# EAGLE design MicroKeyboard (EAGLE 9.6.2)
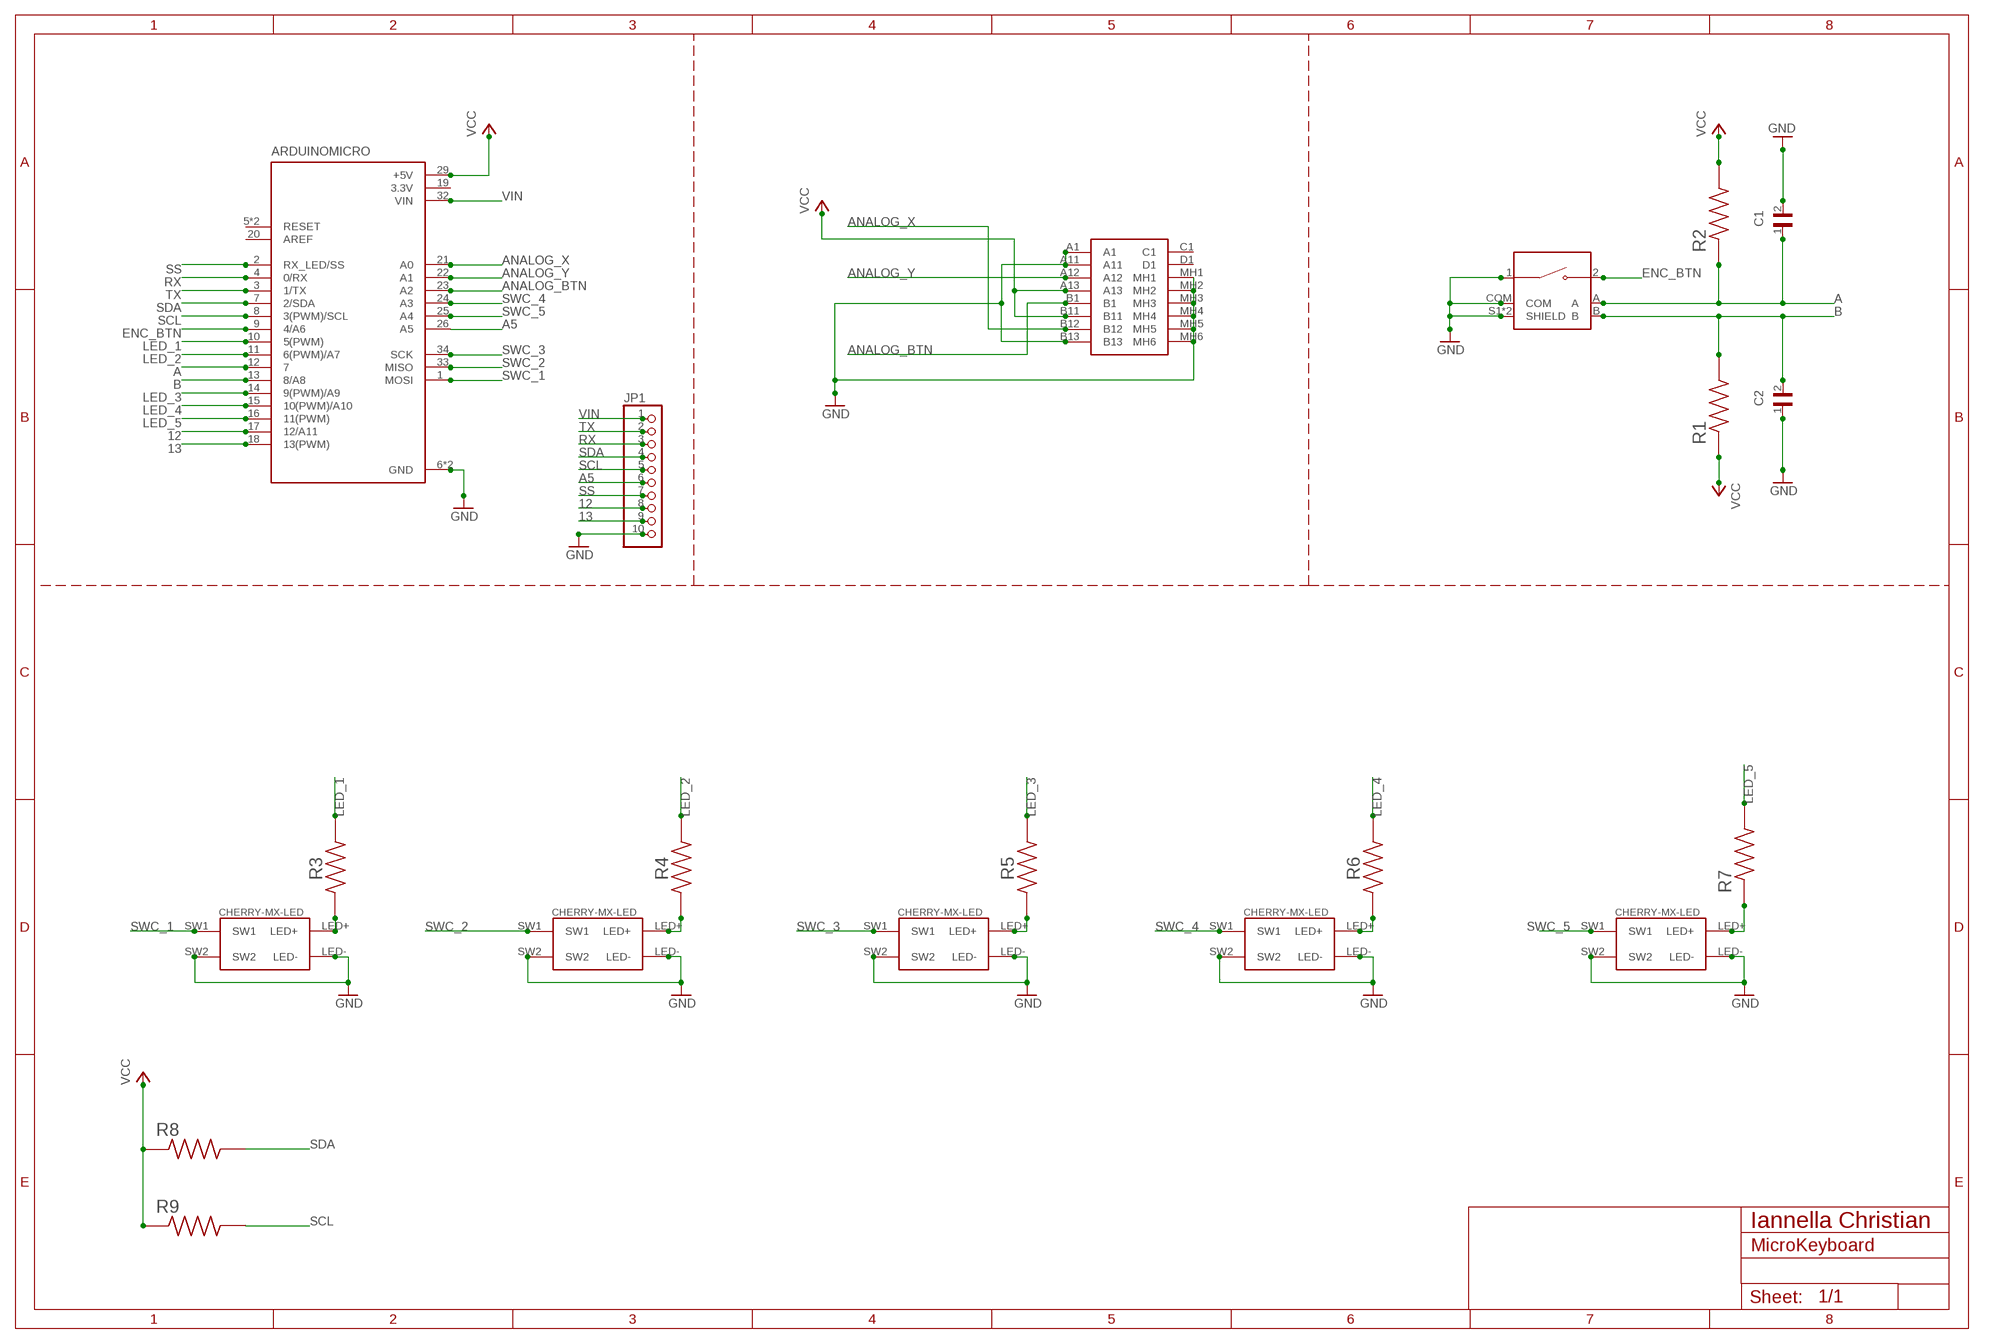
[diagram p0: schematic, sheet 1]

## Parts
ARDUINOMICRO  A000053  [ARDUINO_A000053]
C1  0805YC103J4T2A  [CAPC2012X94N]
C2  0805YC103J4T2A  [CAPC2012X94N]
JP1  PINHD-1X10  [1X10]
MT1  PEC11R-4215F-S0024  [XDCR_PEC11R-4215F-S0024]
R1  RC0805FR-07330RL  [RESC2012X60N]
R2  RC0805FR-07330RL  [RESC2012X60N]
R3  RC0805FR-07330RL  [RESC2012X60N]
R4  RC0805FR-07330RL  [RESC2012X60N]
R5  RC0805FR-07330RL  [RESC2012X60N]
R6  RC0805FR-07330RL  [RESC2012X60N]
R7  RC0805FR-07330RL  [RESC2012X60N]
R8  RC0805FR-07330RL  [RESC2012X60N]
R9  RC0805FR-07330RL  [RESC2012X60N]
S1  RKJXV122400R  [RKJXV122400R]
SWC_1  SWC_1  CHERRY-MX-LED  [CHERRY-MX-LED]
U$1  CHERRY-MX-LED  [CHERRY-MX-LED]
U$2  CHERRY-MX-LED  [CHERRY-MX-LED]
U$3  CHERRY-MX-LED  [CHERRY-MX-LED]
U$5  CHERRY-MX-LED  [CHERRY-MX-LED]

## Nets
12: ARDUINOMICRO.17(12/A11) JP1.8
13: ARDUINOMICRO.18(13(PWM)) JP1.9
A: ARDUINOMICRO.12 C1.1 MT1.A R2.1
A5: ARDUINOMICRO.26(A5) JP1.6
ANALOG_BTN: ARDUINOMICRO.23(A2) S1.B1
ANALOG_X: ARDUINOMICRO.21(A0) S1.B12
ANALOG_Y: ARDUINOMICRO.22(A1) S1.A12
B: ARDUINOMICRO.13(8/A8) C2.2 MT1.B R1.2
ENC_BTN: ARDUINOMICRO.9(4/A6) MT1.2
GND: ARDUINOMICRO.6(GND) ARDUINOMICRO.31(GND) C1.2 C2.1 JP1.10 MT1.1 MT1.COM MT1.S1(SHIELD) MT1.S2(SHIELD) S1.A1 S1.A11 S1.B13 S1.MH1 S1.MH2 S1.MH3 S1.MH4 S1.MH5 S1.MH6 SWC_1.LED- SWC_1.SW2 U$1.LED- U$1.SW2 U$2.LED- U$2.SW2 U$3.LED- U$3.SW2 U$5.LED- U$5.SW2
LED_1: ARDUINOMICRO.10(5(PWM)) R3.2
LED_2: ARDUINOMICRO.11(6(PWM)/A7) R4.2
LED_3: ARDUINOMICRO.14(9(PWM)/A9) R5.2
LED_4: ARDUINOMICRO.15(10(PWM)/A10) R6.2
LED_5: ARDUINOMICRO.16(11(PWM)) R7.2
N$1: R3.1 SWC_1.LED+
N$2: R7.1 U$3.LED+
N$3: R5.1 U$1.LED+
N$4: R4.1 U$5.LED+
N$5: R6.1 U$2.LED+
RX: ARDUINOMICRO.4(0/RX) JP1.3
SCL: ARDUINOMICRO.8(3(PWM)/SCL) JP1.5 R9.2
SDA: ARDUINOMICRO.7(2/SDA) JP1.4 R8.2
SS: ARDUINOMICRO.2(RX_LED/SS) JP1.7
SWC_1: ARDUINOMICRO.1(MOSI) SWC_1.SW1
SWC_2: ARDUINOMICRO.33(MISO) U$5.SW1
SWC_3: ARDUINOMICRO.34(SCK) U$1.SW1
SWC_4: ARDUINOMICRO.24(A3) U$2.SW1
SWC_5: ARDUINOMICRO.25(A4) U$3.SW1
TX: ARDUINOMICRO.3(1/TX) JP1.2
VCC: ARDUINOMICRO.29(+5V) R1.1 R2.2 R8.1 R9.1 S1.A13 S1.B11
VIN: ARDUINOMICRO.32(VIN) JP1.1
Unconnected: ARDUINOMICRO.5(RESET) ARDUINOMICRO.20(AREF) ARDUINOMICRO.30(RESET) S1.C1 S1.D1

## Notes on the sheet
- Iannella Christian

## Power pins joined to a net without a drawn wire
3.3V: ARDUINOMICRO.19(3.3V)

## Library data of the parts
ARDUINOMICRO = A000053:A000053: MCU, ARDUINO MICRO, LEONARDO BASED, ATMEGA32u4, 5V, USB-MICRO Check availability <https://pricing.snapeda.com/parts/Arduino%20Micro/Arduino/view-part?ref=eda>; AVAILABILITY: Not in stock; DESCRIPTION: Microcontroller board based on the ATmega32u4; MF: Arduino; MP: Arduino Micro; PACKAGE: Non-Standard Arduino; PRICE: None
C1 C2 = 0805YC103J4T2A:0805YC103J4T2A: Cap Ceramic 0.01uF 16V X7R 5% SMD 0805 125°C Paper T/R Check availability <https://pricing.snapeda.com/parts/0805YC103J4T2A/AVX/view-part?ref=eda>; AVAILABILITY: In Stock; DESCRIPTION: 10000 pF ±5% 16V Ceramic Capacitor X7R 0805 (2012 Metric); MF: AVX; MP: 0805YC103J4T2A; PACKAGE: 2012 AVX; PRICE: None; PURCHASE-URL: https://pricing.snapeda.com/search/part/0805YC103J4T2A/?ref=eda
JP1 = pinhead:PINHD-1X10: PIN HEADER
MT1 = PEC11R-4215F-S0024:PEC11R-4215F-S0024: Incremental Encoder, 12 Mm, Contact Rating 10 Ma - 5 Vdc Check availability <https://pricing.snapeda.com/parts/PEC11R-4215F-S0024/Bourns/view-part?ref=eda>; AVAILABILITY: In Stock; DESCRIPTION: Rotary Encoder Mechanical 24 Quadrature (Incremental) Vertical; MF: Bourns; MP: PEC11R-4215F-S0024; PACKAGE: None; PRICE: None; PURCHASE-URL: https://pricing.snapeda.com/search/part/PEC11R-4215F-S0024/?ref=eda
R1-R9 = RC0805FR-07330RL:RC0805FR-07330RL: Resistor SMD [YAGEO] RC0805FR-07330RL Resistor SMD Check availability <https://pricing.snapeda.com/parts/RC0805FR-07330RL/Yageo/view-part?ref=eda>; AVAILABILITY: In Stock; DESCRIPTION: 330 Ohms ±1% 0.125W, 1/8W Chip Resistor 0805 (2012 Metric) Moisture Resistant Thick Film; MF: Yageo; MP: RC0805FR-07330RL; PACKAGE: 2012 Rohm Semiconductor; PRICE: None; PURCHASE-URL: https://pricing.snapeda.com/search/part/RC0805FR-07330RL/?ref=eda
S1 = RKJXV122400R:RKJXV122400R: RKJXV122400R Source: Datasheet <https://tech.alpsalpine.com/prod/e/html/multicontrol/potentiometer/rkjxk/rkjxv122400r.html>; DESCRIPTION: RKJXV122400R; HEIGHT: 18.95mm; MANUFACTURER_NAME: ALPS Electric; MANUFACTURER_PART_NUMBER: RKJXV122400R; MOUSER_PART_NUMBER: 688-RKJXV122400R; MOUSER_PRICE-STOCK: https://www.mouser.co.uk/ProductDetail/Alps-Alpine/RKJXV122400R?qs=GedFDFLaBXEbB%252ByoOVwLBg%3D%3D
SWC_1 U$1-U$3 U$5 = cherrymx:CHERRY-MX-LED: Cherry MX series keyswitch with LED

## Board
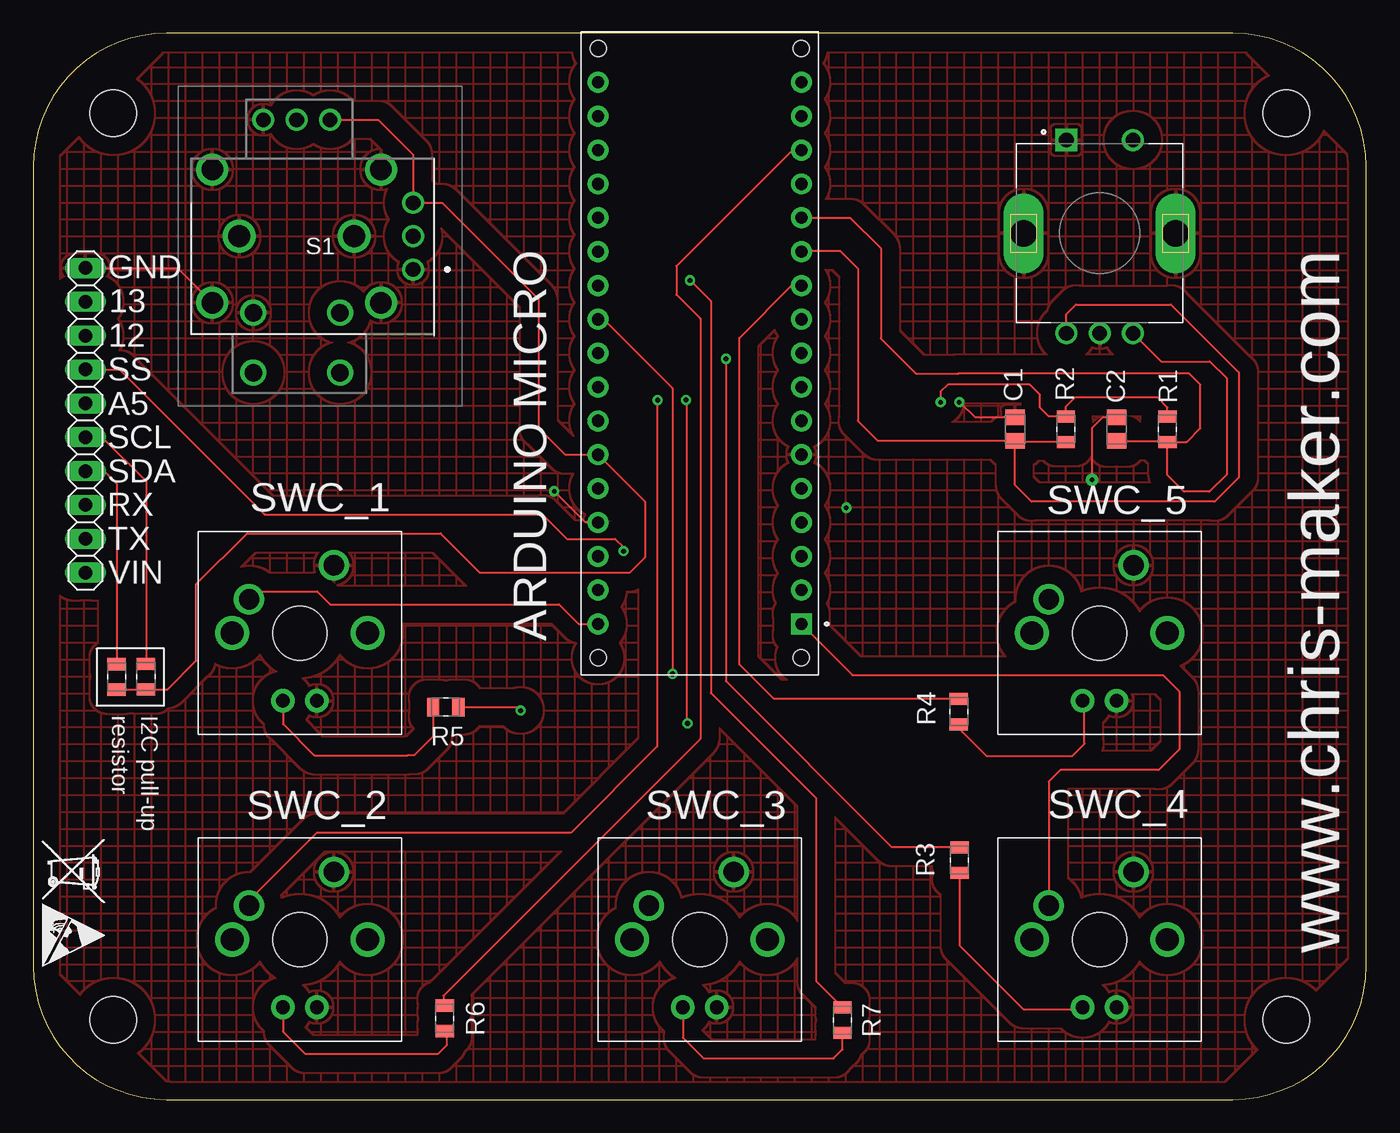
[diagram p1: board, top side]
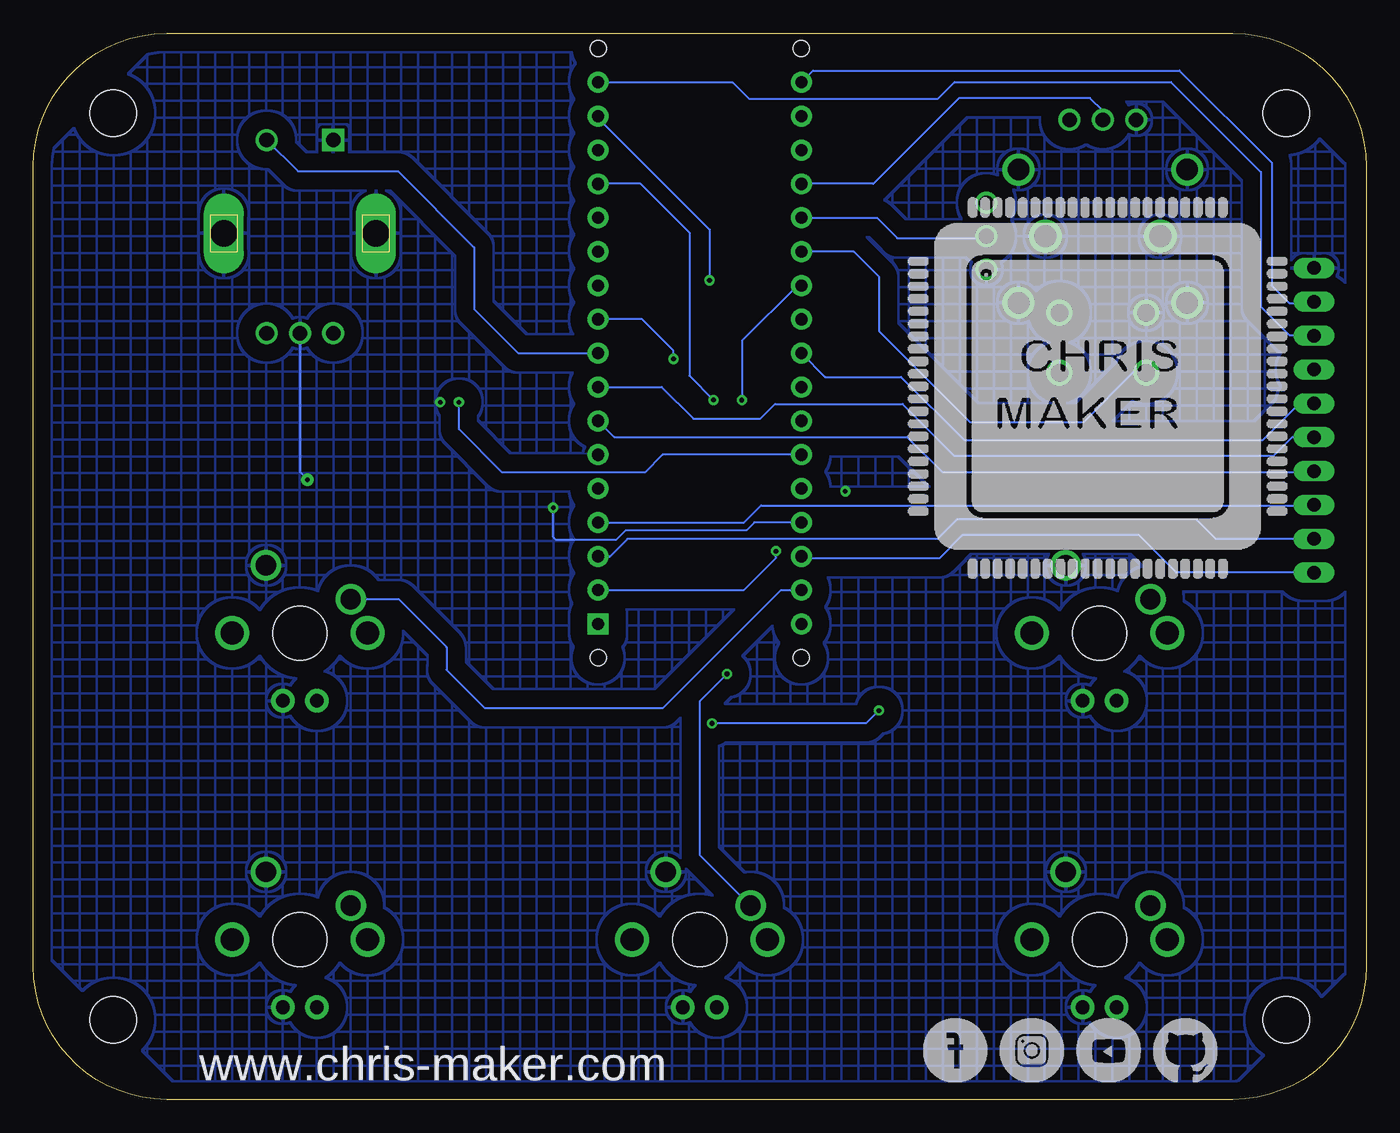
[diagram p2: board, bottom side, seen from below]

Size 100 x 80 mm. Coordinates in mm from the lower left corner, seen from the top.
Outline: 0,10 arc90 10,0 90,0 arc90 100,10 100,70 arc90 90,80 10,80 arc90 0,70 0,10
Copper layers (1*16): Top 0.035mm / dielectric 1.5mm / Bottom 0.035mm
Design rules "default": minimum track width 6mil, minimum drill 0.35mm, track to track 6mil, track to pad 6mil, pad to pad 6mil, via to via 6mil, smd to smd 6mil, copper to edge 40mil, drill to drill 6mil, minimum pad ring 10mil, minimum via ring 8mil, stop-mask expansion 4mil, vias tented up to drill 0mil, thermal gap 10mil
Holes 3.5 mm at 6,74 6,6 94,6 94,74

### Footprints (pad centres in the part's own frame; a part is rotated, then mirrored left to right if it is on the bottom)
ARDUINO_A000053 = drill 0.914 pad 1.575 square: 1 -7.62,20.32 | drill 0.914 pad 1.575: 2 -7.62,17.78; 3 -7.62,15.24; 4 -7.62,12.7; 5 -7.62,10.16; 6 -7.62,7.62; 7 -7.62,5.08; 8 -7.62,2.54; 9 -7.62,0; 10 -7.62,-2.54; 11 -7.62,-5.08; 12 -7.62,-7.62; 13 -7.62,-10.16; 14 -7.62,-12.7; 15 -7.62,-15.24; 16 -7.62,-17.78; 17 -7.62,-20.32; 18 7.62,-20.32; 19 7.62,-17.78; 20 7.62,-15.24; 21 7.62,-12.7; 22 7.62,-10.16; 23 7.62,-7.62; 24 7.62,-5.08; 25 7.62,-2.54; 26 7.62,0; 27 7.62,2.54; 28 7.62,5.08; 29 7.62,7.62; 30 7.62,10.16; 31 7.62,12.7; 32 7.62,15.24; 33 7.62,17.78; 34 7.62,20.32 | hole 1.2: -7.62,-22.86; 7.62,-22.86; -7.62,22.86; 7.62,22.86
CAPC2012X94N = smd 1.16 x 1.47: 1 -0.88,0; 2 0.88,0
1X10 = drill 1.016 long: 1 -11.43,0; 2 -8.89,0; 3 -6.35,0; 4 -3.81,0; 5 -1.27,0; 6 1.27,0; 7 3.81,0; 8 6.35,0; 9 8.89,0; 10 11.43,0
XDCR_PEC11R-4215F-S0024 = drill 1.1 square: 1 -2.5,7 | drill 1.1: 2 2.5,7; A -2.5,-7.5; B 2.5,-7.5; COM 0,-7.5 | drill 2 long: S1 -5.7,0; S2 5.7,0
RESC2012X60N = smd 0.92 x 1.38: 1 -0.955,0; 2 0.955,0
RKJXV122400R = drill 1.3 pad 1.95: A1 -11.98,-3.25; B1 -11.98,-7.75; C1 -5.48,-3.25; D1 -5.48,-7.75 | drill 1.1 pad 1.65: A11 0,0; A12 0,2.5; A13 0,5; B11 -6.23,11.23; B12 -8.73,11.23; B13 -11.23,11.23 | drill 1.6 pad 2.4: MH1 -15.055,-2.5; MH2 -15.055,7.5; MH3 -2.405,-2.5; MH4 -2.405,7.5 | drill 1.65 pad 2.475: MH5 -13.03,2.5; MH6 -4.43,2.5
CHERRY-MX-LED = drill 1.016 pad 1.778: LED+ -1.27,-5.08; LED- 1.27,-5.08 | drill 1.714 pad 1.93: P$3 -5.08,0; P$4 5.08,0 | drill 1.524 pad 2.286: SW1 -3.81,2.54; SW2 2.54,5.08 | hole 4.064: 0,0

### Placement (x,y rotation side)
ARDUINOMICRO  50,56 180 top
C1  73.66,50.29 90 top
C2  81.28,50.29 270 top
JP1  3.91,50.96 90 top
MT1  80,65 0 top
R1  85.09,50.29 270 top
R2  77.47,50.29 90 top
R3  69.49,17.96 90 top
R4  69.44,29.1 90 top
R5  30.94,29.45 0 top
R6  30.87,6.09 90 top
R7  60.71,5.96 90 top
R8  6.25,31.71 90 top
R9  8.45,31.73 90 top
S1  28.49,62.28 0 top
SWC_1  80,12 0 top
U$1  20,35 0 top
U$2  20,12 0 top
U$3  50,12 0 top
U$5  80,35 0 top

### Tracks (layer width: path | path; a pad name or v marks a point on that pad's centre or on a via)
12
  Bottom 0.152: ARDUINOMICRO.17 47.54,76.32 46.32,75.1 32.12,75.1 30.88,76.34 14.64,76.34 7.9,69.6 7.9,59.48 5.77,57.34 3.94,57.34 JP1.8
13
  Bottom 0.152: ARDUINOMICRO.18 41.49,77.21 14,77.21 7.1,70.31 7.1,61.07 5.77,59.74 4.02,59.74 JP1.9
A
  Top 0.152: MT1.A 77.5,58.92 78.24,59.66 85.35,59.66 90.45,54.56 90.45,46.67 88.64,44.87 74.89,44.87 73.66,46.09 73.66,49.38 | 73.66,49.38 C1.1 63.37,49.41 61.86,50.92 61.86,62.34 60.52,63.69 57.69,63.69 ARDUINOMICRO.12 | R2.1 73.7,49.34 73.66,49.38
A5
  Bottom 0.152: ARDUINOMICRO.26 40.6,54.22 34.89,54.22 30.15,49.48 7.75,49.48 5,52.23 JP1.6
ANALOG_BTN
  Bottom 0.152: ARDUINOMICRO.23 38.44,63.62 36.53,61.71 36.53,57.63 29.7,50.81 21.23,50.81 17.5,54.53 S1.B1
ANALOG_X
  Bottom 0.152: ARDUINOMICRO.21 36.98,68.7 30.55,75.13 20.72,75.13 19.76,74.18 S1.B12
ANALOG_Y
  Bottom 0.152: ARDUINOMICRO.22 36.72,66.16 35.18,64.62 28.65,64.62 S1.A12
B
  Top 0.152: MT1.B 84.62,55.38 88.27,55.38 89.53,54.12 89.53,46.91 88.23,45.61 86.33,45.61 85.09,46.85 R1.2 | C2.2 85.02,49.41 R1.2 | R1.2 86.53,49.34 87.57,50.38 87.57,53.63 86.74,54.46 69.39,54.46 69.38,54.47 66.22,54.47 63.58,57.11 63.58,63.87 61.28,66.16 ARDUINOMICRO.13
ENC_BTN
  Bottom 0.152: MT1.2 80.15,69.65 72.63,69.65 66.92,63.93 66.92,59.29 63.62,56 ARDUINOMICRO.9
GND  (via drill 0.35, 0.35 pad 0.95)
  Top 0.152: C1.2 70.69,51.17 v69.47,52.32 | C2.1 80.22,51.17 79.43,50.38 79.43,46.72 79.49,46.66 79.49,46.56 v79.44,46.51 | JP1.10 10.82,62.39 S1.MH1 | ARDUINOMICRO.31 41.42,43.3 v39.08,45.64
  Bottom 0.152: ARDUINOMICRO.31 45.91,43.3 46.5,42.71 55.55,42.71 56.26,42 60.8,42 61,42.2 v61,44.4
  Bottom 0.203: MT1.COM 80,47.07 v79.44,46.51
  pour Top (isolate 1.27, hatched): 1.97,70.83 1.97,9.35 10.23,1.08 89.2,1.08 99.08,10.96 99.08,70.49 91.01,78.56 9.7,78.56
  pour Bottom (isolate 1.27, hatched): 10.13,78.8 1.57,70.24 1.57,9.39 9.87,1.08 89.32,1.08 98.84,10.6 98.84,71.09 91.13,78.8
LED_1  (via drill 0.35)
  Top 0.152: R3.2 64.44,18.92 51.96,31.4 51.96,55.56 v51.97,55.57
  Bottom 0.152: v51.97,55.57 51.97,56.19 54.32,58.54 ARDUINOMICRO.10
LED_2
  Top 0.152: R4.2 55.56,30.06 52.97,32.64 52.97,57.15 56.97,61.14 57.56,61.14 ARDUINOMICRO.11
LED_3  (via drill 0.35)
  Top 0.152: v36.56,29.18 36.3,29.45 R5.2 | v48.97,52.5 49.02,52.44 49.02,28.27 v49.08,28.21
  Bottom 0.152: ARDUINOMICRO.14 54.43,68.7 50.79,65.06 50.79,54.31 v48.97,52.5 | v36.56,29.18 37.5,28.24 49.05,28.24 v49.08,28.21
LED_4
  Top 0.152: ARDUINOMICRO.15 56.94,71.24 48.24,62.54 48.24,60.39 50.04,58.59 50.04,27.07 30.77,7.8 30.77,7.14 R6.2
LED_5  (via drill 0.35)
  Top 0.152: R7.2 58.74,8.88 58.74,22.59 50.84,30.49 50.84,59.89 v49.26,61.47
  Bottom 0.152: v49.26,61.47 49.26,65.27 57.62,73.63 ARDUINOMICRO.16
N$1
  Top 0.152: R3.1 69.49,11.56 74.28,6.77 78.58,6.77 SWC_1.LED+
N$2
  Top 0.152: U$3.LED+ 48.73,4.64 50.28,3.09 60.04,3.09 60.71,3.75 R7.1
N$3
  Top 0.152: U$1.LED+ 18.73,28.18 21.07,25.83 28.1,25.83 28.58,25.83 29.98,27.23 R5.1
N$4
  Top 0.152: R4.1 69.44,27.84 71.49,25.79 77.96,25.79 78.86,26.69 78.86,29.79 U$5.LED+
N$5
  Top 0.152: U$2.LED+ 18.73,5.09 20.39,3.42 30.36,3.42 31.04,4.1 31.04,4.96 R6.1
RX
  Bottom 0.152: ARDUINOMICRO.4 46.67,43.3 45.4,44.57 3.96,44.57 JP1.3
SCL
  Top 0.152: JP1.5 5.15,49.69 8.45,46.39 R9.2
  Bottom 0.152: ARDUINOMICRO.8 52.87,53.46 50.49,51.08 45.46,51.08 44.35,52.19 34.79,52.19 30.91,48.31 6.93,48.31 5.53,49.72 3.94,49.72 JP1.5
SDA
  Top 0.152: JP1.4 5.33,47.15 6.27,46.21 6.27,32.7 R8.2
  Bottom 0.152: ARDUINOMICRO.7 56.42,49.72 34.44,49.72 31.79,47.07 4,47.07 JP1.4
SS  (via drill 0.35)
  Top 0.152: JP1.7 6.49,54.77 17.36,43.9 38.19,43.9 40.03,42.07 43.65,42.07 44.28,41.44 v44.28,41.14
  Bottom 0.152: ARDUINOMICRO.2 46.7,38.22 44.28,40.64 v44.28,41.14
SWC_1
  Top 0.152: ARDUINOMICRO.1 61.45,31.85 84.73,31.85 85.96,30.62 85.96,26.26 84.43,24.72 77.06,24.72 76.19,23.85 SWC_1.SW1
SWC_2
  Bottom 0.152: U$5.SW1 72.6,37.54 69,33.94 69,32.25 66.13,29.38 52.76,29.38 43.91,38.22 ARDUINOMICRO.33
SWC_3
  Top 0.152: U$1.SW1 16.77,38.12 21.3,38.12 22.27,37.15 39.44,37.15 40.91,35.68 ARDUINOMICRO.34
SWC_4  (via drill 0.35)
  Top 0.152: v46.85,52.49 46.8,52.49 46.8,26.48 40.34,20.02 21.27,20.02 16.19,14.94 U$2.SW1
  Bottom 0.152: ARDUINOMICRO.24 42.67,61.08 46.82,56.94 46.82,52.52 v46.85,52.49
SWC_5  (via drill 0.35)
  Top 0.152: ARDUINOMICRO.25 42.78,58.54 47.95,53.37 v47.95,31.94 | v47.95,31.94
  Bottom 0.152: U$3.SW1 50,18.35 50,29.88 v47.95,31.94
TX
  Bottom 0.152: ARDUINOMICRO.3 56.73,40.76 55.42,42.07 32.16,42.07 30.7,43.53 12.74,43.53 11.28,42.07 JP1.2
VCC  (via drill 0.35)
  Top 0.152: R1.1 85.09,51.93 84.32,52.7 78.17,52.7 77.47,52.01 R2.2 76.19,51.25 75.53,51.91 75.53,52.88 74.77,53.64 68.61,53.64 68.07,53.11 v68.07,52.32 | S1.B11 25.88,73.51 28.49,70.9 S1.A13 30.66,67.28 37.9,60.04 37.9,50.38 39.9,48.38 ARDUINOMICRO.29 45.89,44.87 45.89,40.67 44.73,39.51 33.54,39.51 30.56,42.48 16.05,42.48 12.23,38.66 12.23,32.94 10.07,30.77 R9.1 R8.1
  Bottom 0.152: v68.07,52.32 68.07,50.29 64.84,47.06 54.1,47.06 52.78,48.38 ARDUINOMICRO.29
VIN
  Bottom 0.152: JP1.1 14.24,39.53 17.05,42.34 30.28,42.34 32.02,40.6 42.22,40.6 ARDUINOMICRO.32

### Text on the board
tPlace: ARDUINO MICRO | www.chris-maker.com
bPlace: www.chris-maker.com
tNames: GND | 13 | 12 | SS | A5 | SCL | SDA | RX | SWC_1 | SWC_5 | TX | VIN | resistor | I2C pull-up | SWC_2 | SWC_3 | SWC_4